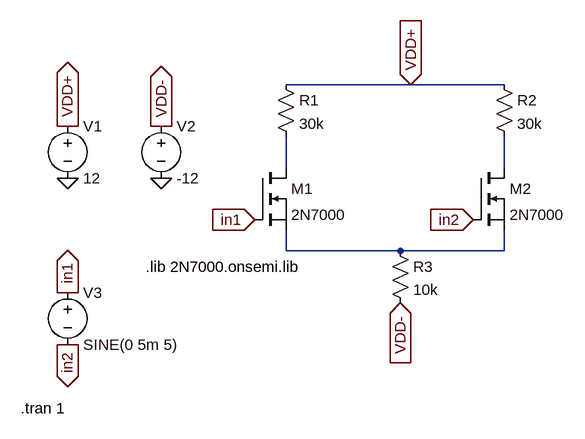
[diagram p0: schematic EW2_project2_diff_amp_iter1.asc]
EW2_project2_diff_amp_iter1.asc, the LTspice schematic file:
Version 4
SHEET 1 880 680
WIRE 272 0 80 0
WIRE 416 0 272 0
WIRE 80 128 80 80
WIRE 416 128 416 80
WIRE 80 256 80 224
WIRE 256 256 80 256
WIRE 416 256 416 224
WIRE 416 256 256 256
FLAG -256 144 0
FLAG -112 144 0
FLAG -256 64 VDD+
IOPIN -256 64 Out
FLAG -112 64 VDD-
IOPIN -112 64 Out
FLAG -256 320 in1
IOPIN -256 320 Out
FLAG -256 400 in2
IOPIN -256 400 Out
FLAG 32 208 in1
IOPIN 32 208 In
FLAG 368 208 in2
IOPIN 368 208 In
FLAG 272 0 VDD+
IOPIN 272 0 In
FLAG 256 336 VDD-
IOPIN 256 336 In
SYMBOL nmos 32 128 R0
SYMATTR InstName M1
SYMATTR Value 2N7000
SYMATTR Prefix X
SYMBOL nmos 368 128 R0
SYMATTR InstName M2
SYMATTR Value 2N7000
SYMATTR Prefix X
SYMBOL res 64 -16 R0
SYMATTR InstName R1
SYMATTR Value 30k
SYMBOL res 400 -16 R0
SYMATTR InstName R2
SYMATTR Value 30k
SYMBOL res 240 240 R0
SYMATTR InstName R3
SYMATTR Value 10k
SYMBOL voltage -256 48 R0
WINDOW 123 0 0 Left 0
WINDOW 39 0 0 Left 0
SYMATTR InstName V1
SYMATTR Value 12
SYMBOL voltage -112 48 R0
WINDOW 123 0 0 Left 0
WINDOW 39 0 0 Left 0
SYMATTR InstName V2
SYMATTR Value -12
SYMBOL voltage -256 304 R0
WINDOW 123 0 0 Left 0
WINDOW 39 0 0 Left 0
SYMATTR InstName V3
SYMATTR Value SINE(0 5m 5)
TEXT -136 280 Left 2 !.lib 2N7000.onsemi.lib
TEXT -328 498 Left 2 !.tran 1

The netlist it stands for:
* EW2_project2_diff_amp_iter1.asc
XM1 N001 in1 N003 2N7000  ; pins D G S
XM2 N002 in2 N003 2N7000  ; pins D G S
R1 VDD+ N001 30k
R2 VDD+ N002 30k
R3 N003 VDD- 10k
V1 VDD+ 0 12
V2 VDD- 0 -12
V3 in1 in2 SINE(0 5m 5)
.lib 2N7000.onsemi.lib
.tran 1
.backanno
.end